# Altium schematic sheet [09] - Slave_Sensor & Output.SchDoc: =ProjectName
size A4; CheckedBy: DatNB; Author: Ven; CompanyName: Nacentech; Organization: IMET
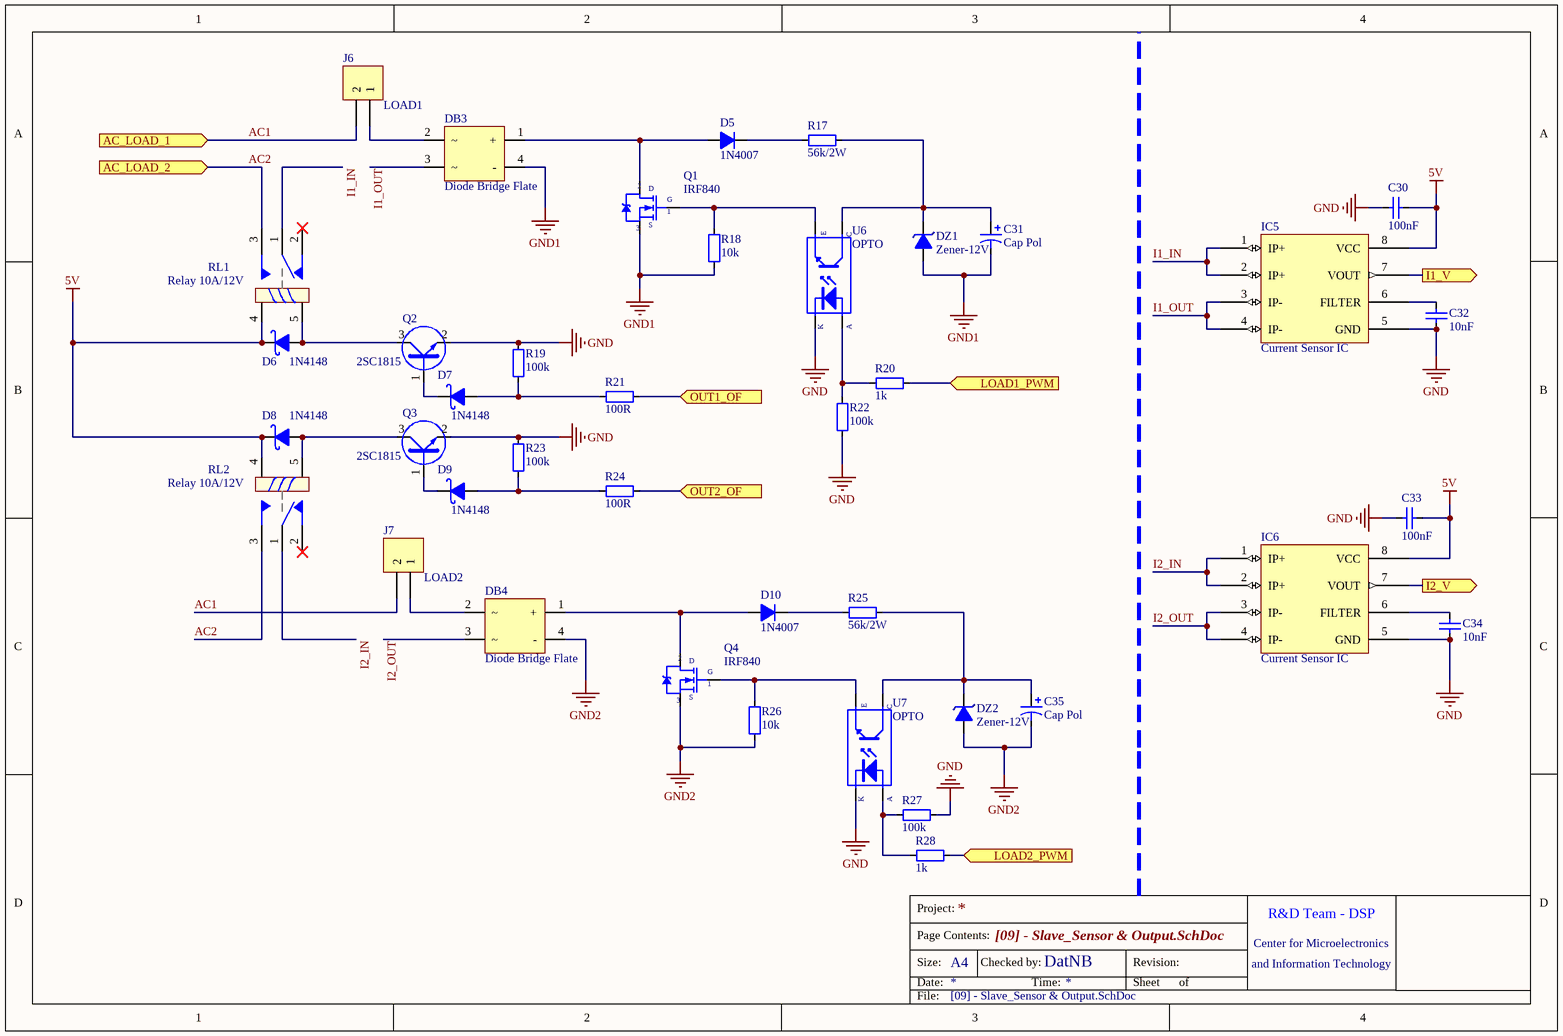
[diagram p0: [09] - Slave_Sensor & Output.SchDoc]

## Parts
C30  100nF  [CAP_0805]
C31  Cap Pol  [C5mm]
C32  10nF  [CAP_0805]
C33  100nF  [CAP_0805]
C34  10nF  [CAP_0805]
C35  Cap Pol  [C5mm]
D5  1N4007  [D2A]
D6  1N4148  [1N4148_SMD]
D7  1N4148  [1N4148_SMD]
D8  1N4148  [1N4148_SMD]
D9  1N4148  [1N4148_SMD]
D10  1N4007  [D2A]
DB3  Diode Bridge Flate  [DB207S]
DB4  Diode Bridge Flate  [DB207S]
DZ1  Zener-12V  [D1A]
DZ2  Zener-12V  [D1A]
IC5  Current Sensor IC  [SOIC-8]
IC6  Current Sensor IC  [SOIC-8]
J6  LOAD1  [KF2-5.08T]
J7  LOAD2  [KF2-5.08T]
Q1  IRF840  [QTO-220H3]
Q2  2SC1815  [SOT23D]
Q3  2SC1815  [SOT23D]
Q4  IRF840  [QTO-220H3]
R17  56k/2W  [RES-2W]
R18  10k  [RES-SMD-0805]
R19  100k  [RES-SMD-0805]
R20  1k  [RES-SMD-0805]
R21  100R  [RES-SMD-0805]
R22  100k  [RES-SMD-0805]
R23  100k  [RES-SMD-0805]
R24  100R  [RES-SMD-0805]
R25  56k/2W  [RES-2W]
R26  10k  [RES-SMD-0805]
R27  100k  [RES-SMD-0805]
R28  1k  [RES-SMD-0805]
RL1  Relay 10A/12V  [RL_SPDT_10A]
RL2  Relay 10A/12V  [RL_SPDT_10A]
U6  OPTO  [OPTO]
U7  OPTO  [OPTO]

## Ports
AC_LOAD_1 (in), AC_LOAD_2 (in), I1_V (out), I2_V (out), LOAD1_PWM (in), LOAD2_PWM (in), OUT1_OF (in), OUT2_OF (in)

## Nets
5V: C30.1 C33.1 D6.2(K) D8.2(K) IC5.8(VCC) IC6.8(VCC) RL1.4 RL2.4
GND: C30.2 C32.1 C33.2 C34.1 IC5.5(GND) IC6.5(GND) Q2.2(E) Q3.2(E) R19.2 R22.1 R23.2 R27.1 U6.K U7.K
GND1: C31.2 DB3.4(-) DZ1.1(A) Q1.3(S) R18.1
GND2: C35.2 DB4.4(-) DZ2.1(A) Q4.3(S) R26.1
AC1: J6.2 J7.2 ; port AC_LOAD_1
AC2: RL1.3 RL2.3 ; port AC_LOAD_2
I1_IN: IC5.1(IP+) IC5.2(IP+) RL1.1
I1_OUT: DB3.3 IC5.3(IP-) IC5.4(IP-)
I1_V: IC5.7(VOUT) ; port I1_V
I2_IN: IC6.1(IP+) IC6.2(IP+) RL2.1
I2_OUT: DB4.3 IC6.3(IP-) IC6.4(IP-)
I2_V: IC6.7(VOUT) ; port I2_V
LOAD1_PWM: R20.2 ; port LOAD1_PWM
LOAD2_PWM: R28.2 ; port LOAD2_PWM
OUT1_OF: R21.2 ; port OUT1_OF
OUT2_OF: R24.2 ; port OUT2_OF
NetC31_1: C31.1 DZ1.2(K) R17.2 U6.C
NetC32_2: C32.2 IC5.6(FILTER)
NetC34_2: C34.2 IC6.6(FILTER)
NetC35_1: C35.1 DZ2.2(K) R25.2 U7.C
NetD5_1: D5.1(A) DB3.1(+) Q1.2(D)
NetD5_2: D5.2(K) R17.1
NetD6_1: D6.1(A) Q2.3(C) RL1.5
NetD7_1: D7.1(A) R19.1 R21.1
NetD7_2: D7.2(K) Q2.1(B)
NetD8_1: D8.1(A) Q3.3(C) RL2.5
NetD9_1: D9.1(A) R23.1 R24.1
NetD9_2: D9.2(K) Q3.1(B)
NetD10_1: D10.1(A) DB4.1(+) Q4.2(D)
NetD10_2: D10.2(K) R25.1
NetDB3_2: DB3.2 J6.1
NetDB4_2: DB4.2 J7.1
NetQ1_1: Q1.1(G) R18.2 U6.E
NetQ4_1: Q4.1(G) R26.2 U7.E
NetR20_1: R20.1 R22.2 U6.A
NetR27_2: R27.2 R28.1 U7.A

Not connected (* = marked no-connect by the designer): RL1 2*; RL2 2*

## Notes on the sheet
- Project:
- R&D Team - DSP
- Page Contents:
- Size:
- Date:
- A4
- Checked by:
- Time:
- Revision:
- Sheet
- of
- Center for Microelectronics
- and Information Technology
- File:

## Library data of the parts
C30 C32-C34 = CapSMD: Capacitor; Value: 33p; Published: 8-Jun-2000; LatestRevisionDate: 17-Jul-2002; LatestRevisionNote: Re-released for DXP Platform.; PackageReference: RAD-0.3; Publisher: Altium Limited
C31 C35 = Cap Pol: Polarized Capacitor (Axial); Published: 8-Jun-2000; LatestRevisionDate: 17-Jul-2002; LatestRevisionNote: Re-released for DXP Platform.; PackageReference: POLAR0.8; Publisher: Altium Limited
D5 D10 = D1A: Diode 1A; Value: 1N4007
D6-D9 = 1N5822: Schottky Rectifiers; Value: Diode c?m 1N5408
DB3 DB4 = Diode Bridge Flate: Diode Bridge
DZ1 DZ2 = Zener
IC5 IC6 = ACS712
J6 J7 = KF2: Manufacturer: Würth Elektronik eiSos GmbH; partNo: 691103110002; ComponentLink1 Description: Manufacturer; ComponentLink2 Description: Datasheet; NoPins: 2; Created Date: 29 October 2013; ComponentLink1URL: http://www.we-online.com; ComponentLink2URL: http://katalog.we-online.de/em/datasheet/6911031100xx.pdf; Created by: Karrer Zheng
Q1 Q4 = IRF840: MOSFET N - CHANNEL 500V - 0.75 - 8A - TO-220; Value: IRF840
Q2 Q3 = 2SC1815: NPN 600mW, ECB; Value: C1815
R17 R18 R25 R26 = Resistor - DIP: Value: R1/4W - 1K
R19-R24 R27 R28 = Resistor - SMD: Resistor; Manufacturer: Generic Components; Class: Passive; Published: 08/06/2000; Publisher: Altium Hobart Technology Centre
RL1 RL2 = Relay 1: Relay SPDT,10A - 12VDC 5 Pin; Value: Relay SPDT, 10A, 12V
U6 U7 = OPTO: Single Opto; pin to pad: A>1 C>4 E>3 K>2; Value: TLP5211